# Altium schematic sheet Sheet1.SchDoc
size A4; SheetNumber: 1; SheetTotal: 1
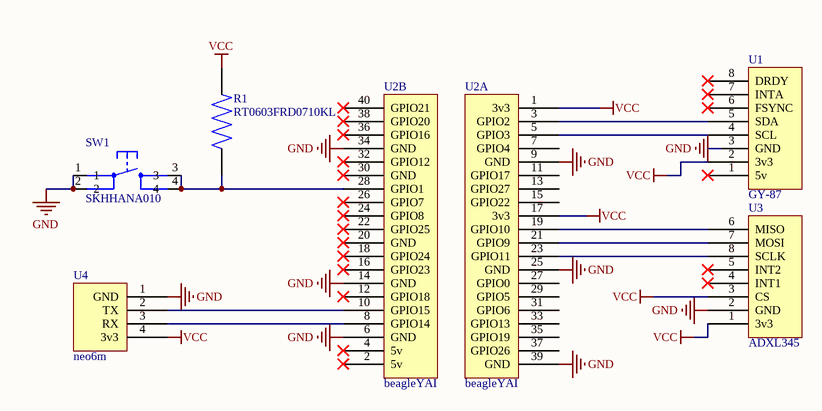
[diagram p0: Sheet1.SchDoc]

## Parts
R1  RT0603FRD0710KL  [RESC1608X55N]
SW1  SKHHANA010  [SW_SKHHANA010]
U1  GY-87  [single8pinfemale]
U2  beagleYAI  [40pinfemale]  (parts A,B of 2)
U3  ADXL345  [single8pinfemale]
U4  neo6m  [single4pinfemale]

## Nets
GND: SW1.1 SW1.2 U1.3(GND) U2.6(GND) U2.9(GND) U2.14(GND) U2.25(GND) U2.34(GND) U2.39(GND) U3.2(GND) U4.1(GND)
VCC: R1.2 U1.2(3v3) U2.1(3v3) U2.17(3v3) U3.1(3v3) U3.3(CS) U4.4(3v3)
NetR1_1: R1.1 SW1.3 SW1.4 U2.28(GPIO1)
NetU1_4: U1.4(SCL) U2.5(GPIO3)
NetU1_5: U1.5(SDA) U2.3(GPIO2)
NetU2_8: U2.8(GPIO14) U4.3(RX)
NetU2_10: U2.10(GPIO15) U4.2(TX)
NetU2_19: U2.19(GPIO10) U3.6(MISO)
NetU2_21: U2.21(GPIO9) U3.7(MOSI)
NetU2_23: U2.23(GPIO11) U3.8(SCLK)

Not connected (* = marked no-connect by the designer): U1 1(5v)* 6(FSYNC)* 7(INTA)* 8(DRDY)*; U2 2(5v)* 4(5v)* 7(GPIO4) 11(GPIO17) 12(GPIO18)* 13(GPIO27) 15(GPIO22) 16(GPIO23)* 18(GPIO24)* 20(GND)* 22(GPIO25)* 24(GPIO8)* 26(GPIO7)* 27(GPIO0) 29(GPIO5) 30(GND)* 31(GPIO6) 32(GPIO12)* 33(GPIO13) 35(GPIO19) 36(GPIO16)* 37(GPIO26) 38(GPIO20)* 40(GPIO21)*; U3 4(INT1)* 5(INT2)*

## Library data of the parts
R1 = RT0603FRD0710KL: Res Thin Film 0603 10K Ohm 1% 0.1W(1/10W) Â±25ppm/C Molded SMD Paper T/R; MF: Yageo; SnapEDA_Link: https://www.snapeda.com/parts/RT0603FRD0710KL/Yageo/view-part/?ref=snap; Package: 1608 Yageo; Value: *; MP: RT0603FRD0710KL; Check_prices: https://www.snapeda.com/parts/RT0603FRD0710KL/Yageo/view-part/?ref=eda
SW1 = SKHHANA010: Switch Tactile N.O. SPST Round Button PC Pins 0.05A 12VDC 0.98N Thru-Hole Bulk; MF: ALPS; SnapEDA_Link: https://www.snapeda.com/parts/SKHHANA010/ALPS/view-part/?ref=snap; Package: None; Value: *; MP: SKHHANA010; Check_prices: https://www.snapeda.com/parts/SKHHANA010/ALPS/view-part/?ref=eda
U1 = GY-87: ComponentLink1Description: Purchase; ComponentLink1URL: *; ComponentLink2Description: Datasheet; ComponentLink2URL: *; Manufacturer: *; Partnumber: *
U2 = beagleYAI: ComponentLink1Description: Purchase; ComponentLink1URL: *; ComponentLink2Description: Datasheet; ComponentLink2URL: *; Manufacturer: *; Partnumber: *
U3 = ADXL345: ComponentLink1Description: Purchase; ComponentLink1URL: *; ComponentLink2Description: Datasheet; ComponentLink2URL: *; Manufacturer: *; Partnumber: *
U4 = neo6m: ComponentLink1Description: Purchase; ComponentLink1URL: *; ComponentLink2Description: Datasheet; ComponentLink2URL: *; Manufacturer: *; Partnumber: *